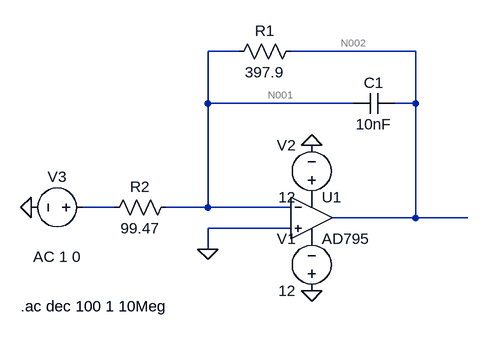
[diagram p0: schematic task1.asc]
task1.asc, the LTspice schematic file:
Version 4.1
SHEET 1 880 680
WIRE 96 -64 48 -64
WIRE 368 -64 176 -64
WIRE 48 16 48 -64
WIRE 272 16 48 16
WIRE 368 16 368 -64
WIRE 368 16 336 16
WIRE -96 176 -144 176
WIRE 48 176 48 16
WIRE 48 176 -16 176
WIRE 176 176 48 176
WIRE 368 192 368 16
WIRE 368 192 240 192
WIRE 448 192 368 192
WIRE 176 208 48 208
WIRE 48 240 48 208
FLAG 208 80 0
FLAG 208 304 0
FLAG -224 176 0
FLAG 48 240 0
SYMBOL voltage 208 320 R180
WINDOW 0 24 96 Left 2
WINDOW 3 24 16 Left 2
WINDOW 123 0 0 Left 0
WINDOW 39 0 0 Left 0
SYMATTR InstName V1
SYMATTR Value 12
SYMBOL voltage 208 176 R180
WINDOW 0 24 96 Left 2
WINDOW 3 24 16 Left 2
WINDOW 123 0 0 Left 0
WINDOW 39 0 0 Left 0
SYMATTR InstName V2
SYMATTR Value 12
SYMBOL cap 336 0 R90
WINDOW 0 0 32 VBottom 2
WINDOW 3 32 32 VTop 2
SYMATTR InstName C1
SYMATTR Value 10nF
SYMBOL res 192 -80 R90
WINDOW 0 0 56 VBottom 2
WINDOW 3 32 56 VTop 2
SYMATTR InstName R1
SYMATTR Value 397.9
SYMBOL res 0 160 R90
WINDOW 0 0 56 VBottom 2
WINDOW 3 32 56 VTop 2
SYMATTR InstName R2
SYMATTR Value 99.47
SYMBOL voltage -128 176 R90
WINDOW 0 -32 56 VBottom 2
WINDOW 3 32 56 VTop 2
WINDOW 123 60 56 VTop 2
WINDOW 39 0 0 Left 0
SYMATTR InstName V3
SYMATTR Value ""
SYMATTR Value2 AC 1 0
SYMBOL OpAmps\\AD795 208 128 R0
SYMATTR InstName U1
TEXT -240 328 Left 2 !.ac dec 100 1 10Meg

The netlist it stands for:
* task1.asc
V1 0 P001 12
V2 P002 0 12
C1 N002 N001 10nF
R1 N002 N001 397.9
R2 N001 N003 99.47
V3 N003 0 AC 1 0
X§U1 0 N001 P002 P001 N002 AD795  ; pins In+ In- V+ V- OUT
.ac dec 100 1 10Meg
.lib ADI1.lib
.backanno
.end

* Results of the author's LTspice run, read from the files saved beside the schematic
* Operating Point, zero values left out:
*   V(p001) = -12 V
*   V(p002) = 12 V
*   I(V1) = -1.226 mA
*   I(V2) = -1.226 mA
*   Ix(u1:3) = 1.226 mA
*   Ix(u1:4) = -1.226 mA
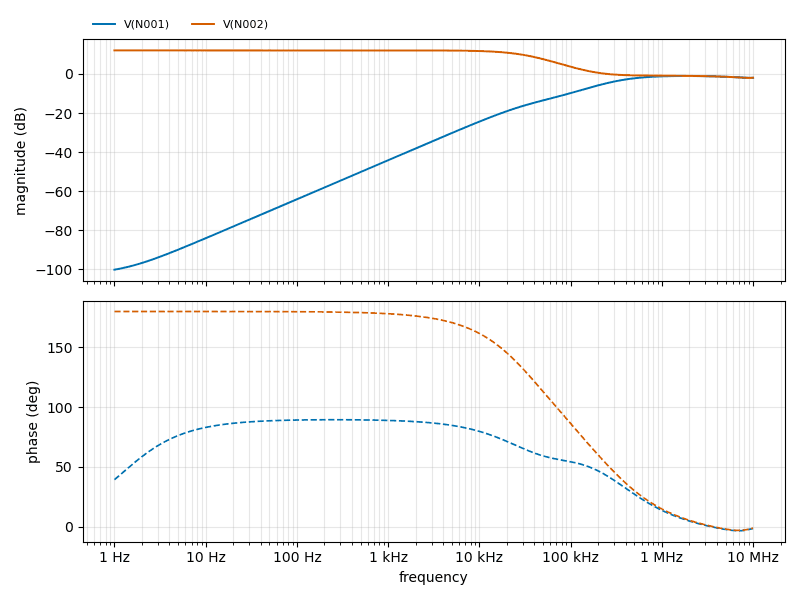
[diagram p1: AC Analysis of task1.asc, plotted from the saved traces]
* AC Analysis, 1 run:
*   V(N001): -100.13 dB at 1 Hz, -1.94 dB at 10 MHz, peak -1.05 dB at 1.82 MHz, 3 dB below the peak at 288.2 kHz
*   V(N002): 12.04 dB at 1 Hz, -1.95 dB at 10 MHz, peak 12.04 dB at 1 Hz, 3 dB below the peak at 36.66 kHz